# EAGLE design minishield-button (EAGLE 7.6.0)
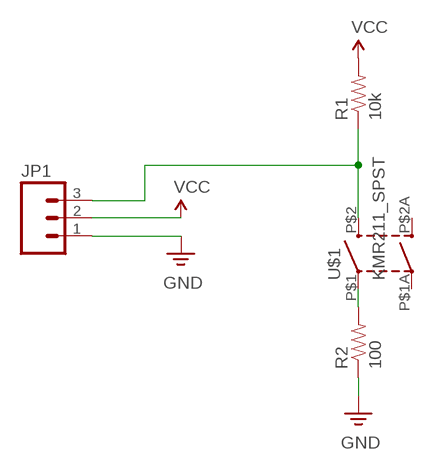
[diagram p0: schematic, sheet 1]

## Parts
JP1  M03PTH  [1X03]
R1  10k  RESISTOR0402-RES  [0402-RES]
R2  100  RESISTOR0402-RES  [0402-RES]
U$1  KMR211_SPST  [KMR211_SPST]

## Nets
GND: JP1.1 R2.1
N$1: JP1.3 R1.1 U$1.P$2(2A)
N$3: R2.2 U$1.P$1(1A)
VCC: JP1.2 R1.2
Unconnected: U$1.P$1A(1B) U$1.P$2A(2B)

## Library data of the parts
JP1 = SparkFun-Connectors:M03: Header 3 Standard 3-pin 0.1" header. Use with straight break away headers (SKU : PRT-00116), right angle break away headers (PRT-00553), swiss pins (PRT-00743), machine pins (PRT-00117), and female headers (PRT-00115). Molex polarized connector foot print use with SKU : PRT-08232 with associated crimp pins and housings.
R1 R2 = SparkFun-Resistors:RESISTOR: Resistor Basic schematic elements and footprints for 0603, 1206, and PTH resistors.
U$1 = my library:KMR211_SPST: KMR, KMR211, SPST

## Board
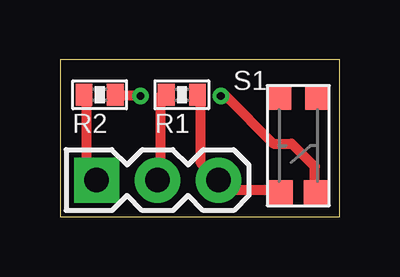
[diagram p1: board, top side]
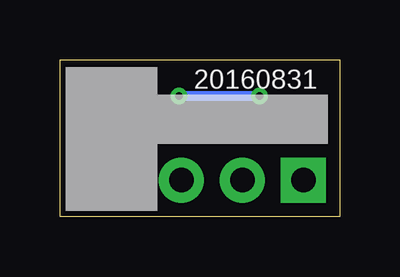
[diagram p2: board, bottom side, seen from below]

Size 11.66 x 6.53 mm. Coordinates in mm from the lower left corner, seen from the top.
Outline: 0,0 11.66,0 11.66,6.53 0,6.53 0,0
Copper layers (1*16): Top 0.0356mm / dielectric 1.5011mm / Bottom 0.0356mm
Design rules "LaenPCBOrder *": minimum track width 16mil, minimum drill 13mil, track to track 6mil, track to pad 6mil, pad to pad 6mil, via to via 6mil, smd to smd 6mil, copper to edge 15mil, drill to drill 6mil, minimum pad ring 7mil, minimum via ring 7mil, stop-mask expansion 3mil, vias tented up to drill 14mil, thermal gap 10mil

### Footprints (pad centres in the part's own frame; a part is rotated, then mirrored left to right if it is on the bottom)
1X03 = drill 1.016 pad 1.88 square: 1 0,0 | drill 1.016 pad 1.88: 2 2.54,0; 3 5.08,0
0402-RES = smd 0.7 x 0.9: 1 -0.65,0; 2 0.65,0
KMR211_SPST = smd 1.067 x 1.067: P$1 4.47,-0.533; P$2 4.47,-2.057 | smd 1 x 1: P$1A 0.5,-0.5; P$2A 0.5,-2.1

### Placement (x,y rotation side)
JP1  1.52,1.52 0 top
R1  5.08,5.08 180 top
R2  1.65,5.08 0 top
U$1  11.23,5.46 270 top

### Tracks (layer width: path | path; a pad name or v marks a point on that pad's centre or on a via)
GND
  Top 0.406: R2.1 1.12,5.03 1.12,1.96 1.4,1.68 JP1.1
N$1
  Top 0.406: R1.1 5.87,5.03 5.87,2.23 6.43,1.68 JP1.3 6.71,1.4 6.99,1.12 8.94,1.12 U$1.P$2
N$3  (via drill 0.33)
  Top 0.406: v3.35,5.03 2.52,5.03 R2.2 | U$1.P$1 10.62,1.12 10.62,2.08 9.65,3.05 8.89,3.05 6.91,5.03 v6.71,5.03
  Bottom 0.406: v6.71,5.03 v3.35,5.03
VCC
  Top 0.406: R1.2 4.19,5.03 4.19,1.68 JP1.2

### Text on the board
tPlace: S1
bPlace: 20160831